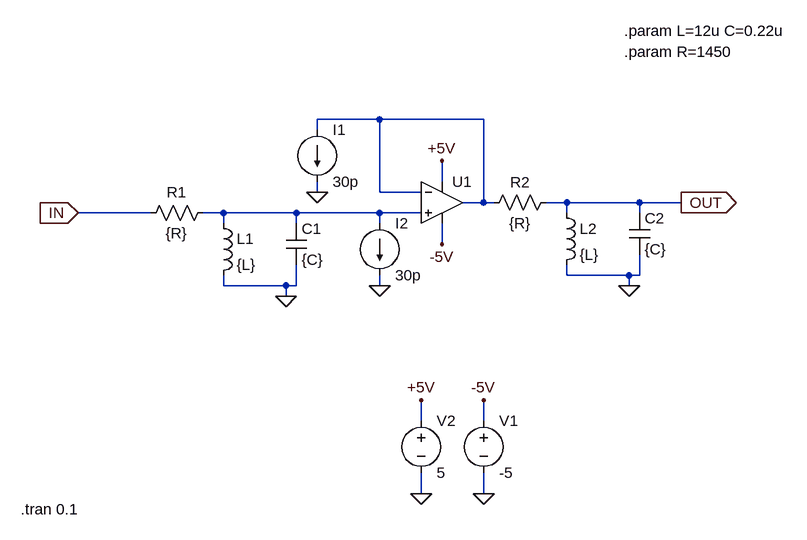
[diagram p0: schematic 4P_BP_Filter.asc]
4P_BP_Filter.asc, the LTspice schematic file:
Version 4
SHEET 1 880 680
WIRE 48 -80 -48 -80
WIRE 208 -80 48 -80
WIRE -48 -64 -48 -80
WIRE 144 16 144 -16
WIRE -48 32 -48 16
WIRE 48 32 48 -80
WIRE 112 32 48 32
WIRE 208 48 208 -80
WIRE 208 48 176 48
WIRE 224 48 208 48
WIRE 336 48 304 48
WIRE 448 48 336 48
WIRE 512 48 448 48
WIRE -304 64 -416 64
WIRE -192 64 -224 64
WIRE -80 64 -192 64
WIRE 48 64 -80 64
WIRE 112 64 48 64
WIRE 336 64 336 48
WIRE 448 64 448 48
WIRE -192 80 -192 64
WIRE -80 80 -80 64
WIRE 48 80 48 64
WIRE 144 112 144 80
WIRE 336 160 336 144
WIRE 432 160 336 160
WIRE 448 160 448 128
WIRE 448 160 432 160
WIRE -192 176 -192 160
WIRE -96 176 -192 176
WIRE -80 176 -80 144
WIRE -80 176 -96 176
WIRE 48 176 48 160
WIRE 432 176 432 160
WIRE -96 192 -96 176
WIRE 112 384 112 352
WIRE 208 384 208 352
WIRE 112 496 112 464
WIRE 208 496 208 464
FLAG 112 496 0
FLAG 208 496 0
FLAG 112 352 +5V
FLAG 208 352 -5V
FLAG 144 -16 +5V
FLAG 144 112 -5V
FLAG -96 192 0
FLAG 432 176 0
FLAG -48 32 0
FLAG 48 176 0
FLAG -416 64 IN
IOPIN -416 64 In
FLAG 512 48 OUT
IOPIN 512 48 Out
SYMBOL OpAmps\\UniversalOpamp2 144 48 R0
SYMATTR InstName U1
SYMATTR Value2 Avol=1Meg GBW=5Meg Slew=12Meg Vos=3m
SYMBOL voltage 208 368 R0
WINDOW 123 0 0 Left 0
WINDOW 39 0 0 Left 0
SYMATTR InstName V1
SYMATTR Value -5
SYMBOL voltage 112 368 R0
WINDOW 123 0 0 Left 0
WINDOW 39 0 0 Left 0
SYMATTR InstName V2
SYMATTR Value 5
SYMBOL res -208 48 R90
WINDOW 0 0 56 VBottom 2
WINDOW 3 32 56 VTop 2
SYMATTR InstName R1
SYMATTR Value {R}
SYMATTR SpiceLine tol=1 pwr=.25
SYMBOL cap -96 80 R0
SYMATTR InstName C1
SYMATTR Value {C}
SYMATTR SpiceLine V=16
SYMBOL ind -208 64 R0
SYMATTR InstName L1
SYMATTR Value {L}
SYMBOL res 320 32 R90
WINDOW 0 0 56 VBottom 2
WINDOW 3 32 56 VTop 2
SYMATTR InstName R2
SYMATTR Value {R}
SYMATTR SpiceLine tol=1 pwr=.25
SYMBOL cap 432 64 R0
SYMATTR InstName C2
SYMATTR Value {C}
SYMATTR SpiceLine V=16
SYMBOL ind 320 48 R0
SYMATTR InstName L2
SYMATTR Value {L}
SYMBOL current -48 -64 R0
WINDOW 123 0 0 Left 0
WINDOW 39 0 0 Left 0
SYMATTR InstName I1
SYMATTR Value 30p
SYMBOL current 48 80 R0
WINDOW 123 0 0 Left 0
WINDOW 39 0 0 Left 0
SYMATTR InstName I2
SYMATTR Value 30p
TEXT 424 -184 Left 2 !.param R=1450
TEXT 424 -216 Left 2 !.param L=12u C=0.22u
TEXT -504 520 Left 2 !.tran 0.1

The netlist it stands for:
* 4P_BP_Filter.asc
XU1 N002 N001 +5V -5V N001 level.2 Avol=1Meg GBW=5Meg Slew=12Meg Vos=3m ilimit=25m rail=0 Vos=0 phimargin=45 en=0 enk=0 in=0 ink=0 Rin=500Meg  ; pins IN+ IN- V+ V- OUT
V1 -5V 0 -5
V2 +5V 0 5
R1 N002 IN {R} tol=1 pwr=.25
C1 N002 0 {C} V=16
L1 N002 0 {L}
R2 OUT N001 {R} tol=1 pwr=.25
C2 OUT 0 {C} V=16
L2 OUT 0 {L}
I1 N001 0 30p
I2 N002 0 30p
.param R=1450
.param L=12u C=0.22u
.tran 0.1
.lib UniversalOpamps2.sub
.backanno
.end